# EAGLE design DS2502_Programmer_V1.0 (EAGLE 9.6.2)
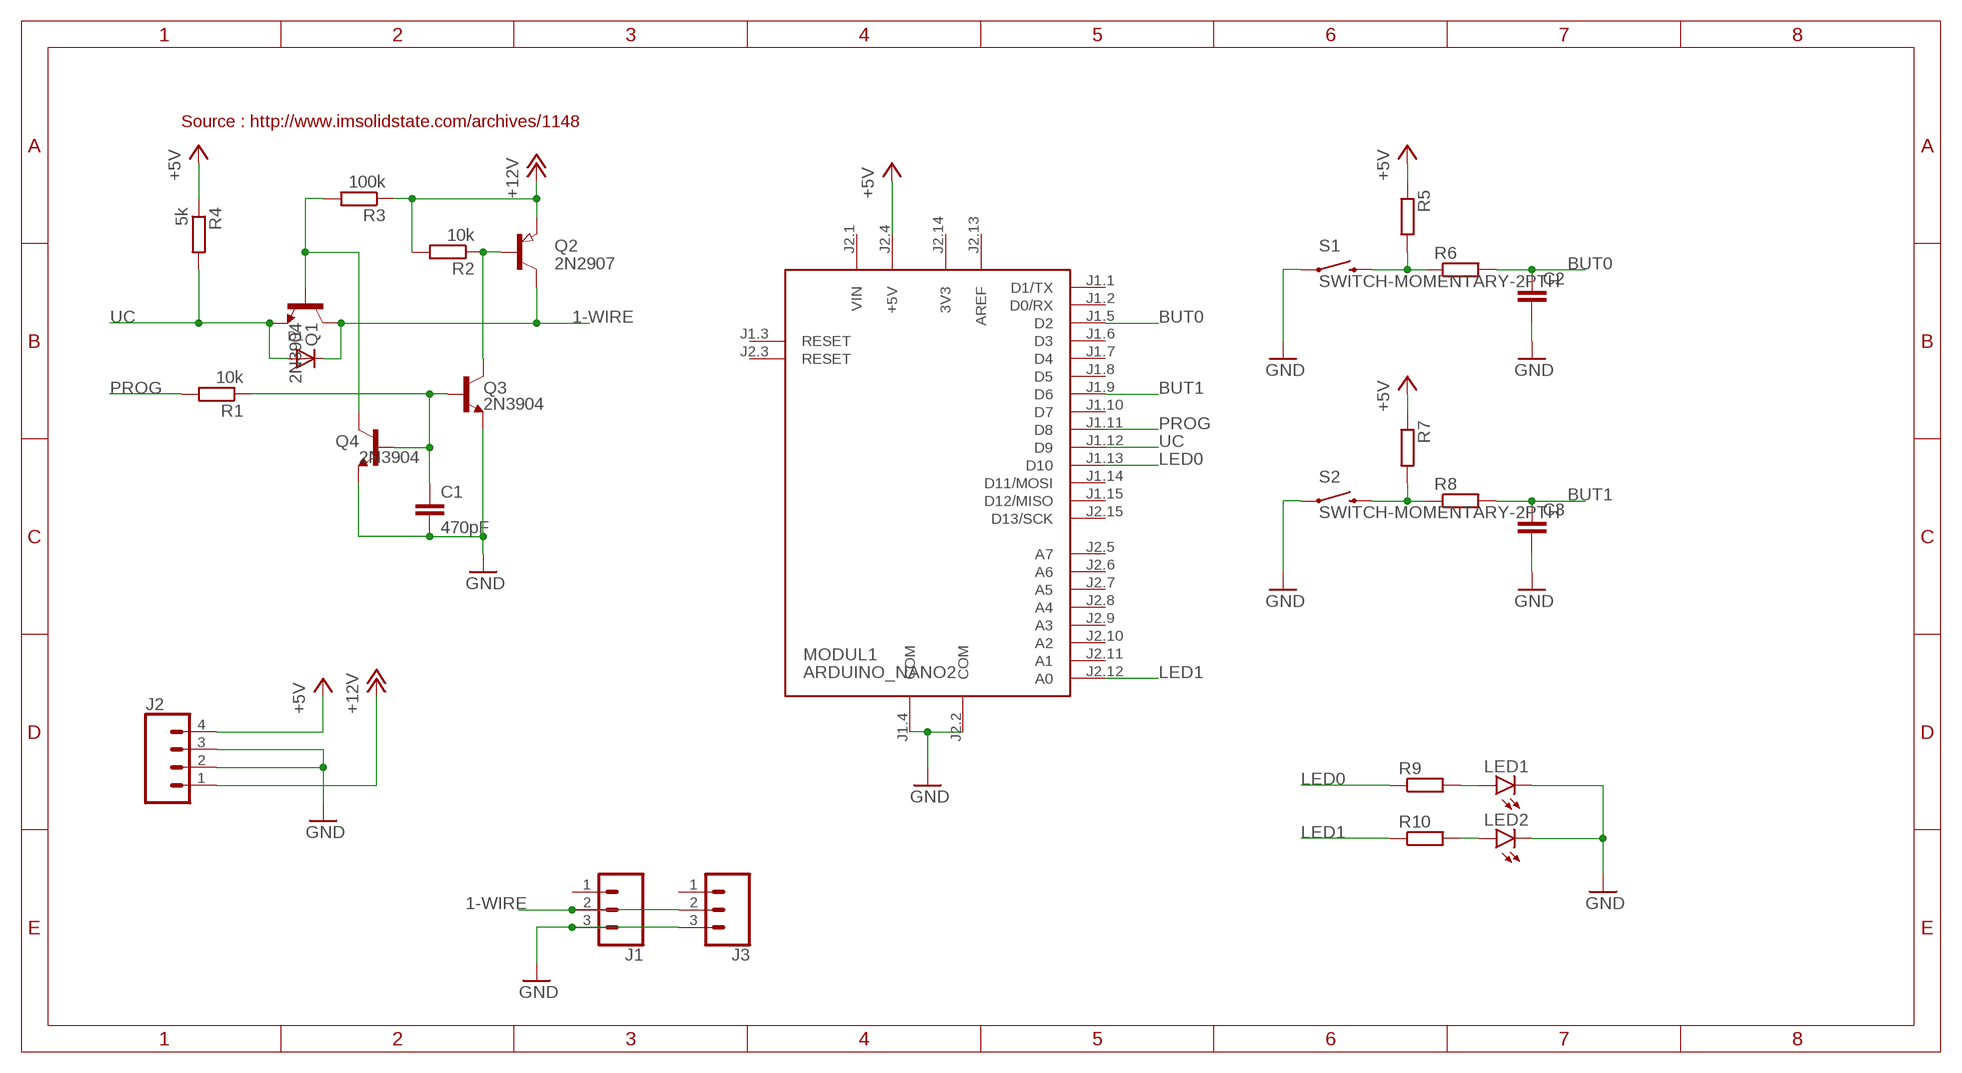
[diagram p0: schematic, sheet 1]

## Parts
C1  470pF  C-EUC0603  [C0603]
C2  C-EUC0603  [C0603]
C3  C-EUC0603  [C0603]
D1  DIODESOD-523  [SOD-523]
J1  CONN_03  [1X03]
J2  CONN_04  [1X04]
J3  CONN_03  [1X03]
LED1  LEDCHIP-LED0805  [CHIP-LED0805]
LED2  LEDCHIP-LED0805  [CHIP-LED0805]
MODUL1  ARDUINO_NANO2  [ARDUINO_NANO2]
Q1  2N3904  TRANS_NPN-MMBTA42  [SOT23-3]
Q2  2N2907  PNP-TRANSISTOR_SOT23  [SOT23]
Q3  2N3904  TRANS_NPN-MMBTA42  [SOT23-3]
Q4  2N3904  TRANS_NPN-MMBTA42  [SOT23-3]
R1  10k  R-EU_R0603  [R0603]
R2  10k  R-EU_R0603  [R0603]
R3  100k  R-EU_R0603  [R0603]
R4  5k  R-EU_R0603  [R0603]
R5  R-EU_R0603  [R0603]
R6  R-EU_R0603  [R0603]
R7  R-EU_R0603  [R0603]
R8  R-EU_R0603  [R0603]
R9  R-EU_R0603  [R0603]
R10  R-EU_R0603  [R0603]
S1  SWITCH-MOMENTARY-2PTH  [TACTILE-PTH]
S2  SWITCH-MOMENTARY-2PTH  [TACTILE-PTH]

## Nets
1-WIRE: D1.K(C) J1.2 J3.2 Q1.3(C) Q2.3(C)
+5V: J2.4 MODUL1.J2.4(+5V) R4.1 R5.1 R7.1
+12V: J2.1 Q2.2(E) R2.2 R3.1
BUT0: C2.1 MODUL1.J1.5(D2) R6.2
BUT1: C3.1 MODUL1.J1.9(D6) R8.2
GND: C1.2 C2.2 C3.2 J1.3 J2.2 J2.3 J3.3 LED1.C LED2.C MODUL1.J1.4(COM) MODUL1.J2.2(COM) Q3.2(E) Q4.2(E) S1.1 S2.1
LED0: MODUL1.J1.13(D10) R9.1
LED1: MODUL1.J2.12(A0) R10.1
N$1: Q2.1(B) Q3.3(C) R2.1
N$2: R5.2 R6.1 S1.3
N$3: R7.2 R8.1 S2.3
N$4: Q1.1(B) Q4.3(C) R3.2
N$5: LED1.A R9.2
N$6: LED2.A R10.2
N$7: C1.1 Q3.1(B) Q4.1(B) R1.1
PROG: MODUL1.J1.11(D8) R1.2
UC: D1.A MODUL1.J1.12(D9) Q1.2(E) R4.2
Unconnected: J1.1 J3.1 MODUL1.J1.1(D1/TX) MODUL1.J1.2(D0/RX) MODUL1.J1.3(RESET) MODUL1.J1.6(D3) MODUL1.J1.7(D4) MODUL1.J1.8(D5) MODUL1.J1.10(D7) MODUL1.J1.14(D11/MOSI) MODUL1.J1.15(D12/MISO) MODUL1.J2.3(RESET) MODUL1.J2.5(A7) MODUL1.J2.6(A6) MODUL1.J2.7(A5) MODUL1.J2.8(A4) MODUL1.J2.9(A3) MODUL1.J2.10(A2) MODUL1.J2.11(A1) MODUL1.J2.15(D13/SCK)

## Notes on the sheet
- Source : http://www.imsolidstate.com/archives/1148

## Power pins joined to a net without a drawn wire
3V3: MODUL1.J2.14(3V3)
AREF: MODUL1.J2.13(AREF)
VIN: MODUL1.J2.1(VIN)

## Library data of the parts
C1-C3 = rcl:C-EU: CAPACITOR, European symbol; SPICEPREFIX: C
D1 = adafruit:DIODE: Diode SMADIODE - SMA Surface Mount Package 20V 1A Schottky Diode Digikey: 641-1014-6-ND DO-1N4148 - Through Hole Small Current Diode SOD-123 20V 1 A (.5mV Vf) Schottky Diode - Digikey: MBRX120TPMSCT-ND SOD-323 10V 570mA (.38mV Vf, 3ns) Schottky Diode - Digikey: ZLLS410CT-ND SOD-523 30V 30mA Schottky Diode (RB751S-40TE61) - Digikey: RB751S-40TE61CT-ND SOT23-R/W - SOT23 Package (R = Solder Paste/Reflow Ovens, W = Hand-Soldering) BAT54Film 40V 300mA - Digikey: 497-7162-1-ND
J1 J3 = SparkFun-Connectors:CONN_03: Multi connection point. Often used as Generic Header-pin footprint for 0.1 inch spaced/style header connections On any of the 0.1 inch spaced packages, you can populate with these: Break Away Headers - Straight <https://www.sparkfun.com/products/116> (PRT-00116) Break Away Male Headers - Right Angle <https://www.sparkfun.com/products/553> (PRT-00553) Female Headers <https://www.sparkfun.com/products/115> (PRT-00115) Break Away Headers - Machine Pin <https://www.sparkfun.com/products/117> (PRT-00117) Break Away Female Headers - Swiss Machine Pin <https://www.sparkfun.com/products/743> (PRT-00743) Stackable Header - 3 Pin (Female, 0.1") <https://www.sparkfun.com/products/13875> (PRT-13875) For SCREWTERMINALS and SPRING TERMINALS visit here: Screw Terimnals on SparkFun.com <https://www.sparkfun.com/search/results?term=Screw+Terminals> (5mm/3.5mm/2.54mm spacing) This device is also useful as a general connection point to wire up your design to another part of your project. Our various solder wires solder well into these plated through hole pads. Hook-Up Wire - Assortment (Stranded, 22 AWG) <https://www.sparkfun.com/products/11375> (PRT-11375) Hook-Up Wire - Assortment (Solid Core, 22 AWG) <https://www.sparkfun.com/products/11367> (PRT-11367) View the entire wire category on our website here <https://www.sparkfun.com/categories/141> Special notes: Molex polarized connector foot print use with SKU : PRT-08232 with associated crimp pins and housings.
J2 = SparkFun-Connectors:CONN_04: Multi connection point. Often used as Generic Header-pin footprint for 0.1 inch spaced/style header connections On any of the 0.1 inch spaced packages, you can populate with these: Break Away Headers - Straight <https://www.sparkfun.com/products/116> (PRT-00116) Break Away Male Headers - Right Angle <https://www.sparkfun.com/products/553> (PRT-00553) Female Headers <https://www.sparkfun.com/products/115> (PRT-00115) Break Away Headers - Machine Pin <https://www.sparkfun.com/products/117> (PRT-00117) Break Away Female Headers - Swiss Machine Pin <https://www.sparkfun.com/products/743> (PRT-00743) For SCREWTERMINALS and SPRING TERMINALS visit here: Screw Terimnals on SparkFun.com <https://www.sparkfun.com/search/results?term=Screw+Terminals> (5mm/3.5mm/2.54mm spacing) This device is also useful as a general connection point to wire up your design to another part of your project. Our various solder wires solder well into these plated through hole pads. Hook-Up Wire - Assortment (Stranded, 22 AWG) <https://www.sparkfun.com/products/11375> (PRT-11375) Hook-Up Wire - Assortment (Solid Core, 22 AWG) <https://www.sparkfun.com/products/11367> (PRT-11367) View the entire wire category on our website here <https://www.sparkfun.com/categories/141> Special notes: Molex polarized connector foot print use with SKU : PRT-08231 with associated crimp pins and housings. 1MM SMD Version SKU: PRT-10208; PROD_ID: CONN-09696
LED1 LED2 = led:LED: LED OSRAM: - CHIPLED LG R971, LG N971, LY N971, LG Q971, LY Q971, LO R971, LY R971 LH N974, LH R974 LS Q976, LO Q976, LY Q976 LO Q996 - Hyper CHIPLED LW Q18S LB Q993, LB Q99A, LB R99A - SideLED LS A670, LO A670, LY A670, LG A670, LP A670 LB A673, LV A673, LT A673, LW A673 LH A674 LY A675 LS A676, LA A676, LO A676, LY A676, LW A676 LS A679, LY A679, LG A679 - Hyper Micro SIDELED® LS Y876, LA Y876, LO Y876, LY Y876 LT Y87S - SmartLED LW L88C, LW L88S LB L89C, LB L89S, LG L890 LS L89K, LO L89K, LY L89K LS L896, LA L896, LO L896, LY L896 - TOPLED LS T670, LO T670, LY T670, LG T670, LP T670 LSG T670, LSP T670, LSY T670, LOP T670, LYG T670 LG T671, LOG T671, LSG T671 LB T673, LV T673, LT T673, LW T673 LH T674 LS T676, LA T676, LO T676, LY T676, LB T676, LH T676, LSB T676, LW T676 LB T67C, LV T67C, LT T67C, LS T67K, LO T67K, LY T67K, LW E67C LS E67B, LA E67B, LO E67B, LY E67B, LB E67C, LV E67C, LT E67C LW T67C LS T679, LY T679, LG T679 LS T770, LO T770, LY T770, LG T770, LP T770 LB T773, LV T773, LT T773, LW T773 LH T774 LS E675, LA E675, LY E675, LS T675 LS T776, LA T776, LO T776, LY T776, LB T776 LHGB T686 LT T68C, LB T68C - Hyper Mini TOPLED® LB M676 - Mini TOPLED Santana® LG M470 LS M47K, LO M47K, LY M47K Source: http://www.osram.convergy.de LUXEON: - LUMILED® LXK2-PW12-R00, LXK2-PW12-S00, LXK2-PW14-U00, LXK2-PW14-V00 LXK2-PM12-R00, LXK2-PM12-S00, LXK2-PM14-U00 LXK2-PE12-Q00, LXK2-PE12-R00, LXK2-PE12-S00, LXK2-PE14-T00, LXK2-PE14-U00 LXK2-PB12-K00, LXK2-PB12-L00, LXK2-PB12-M00, LXK2-PB14-N00, LXK2-PB14-P00, LXK2-PB14-Q00 LXK2-PR12-L00, LXK2-PR12-M00, LXK2-PR14-Q00, LXK2-PR14-R00 LXK2-PD12-Q00, LXK2-PD12-R00, LXK2-PD12-S00 LXK2-PH12-R00, LXK2-PH12-S00 LXK2-PL12-P00, LXK2-PL12-Q00, LXK2-PL12-R00 Source: www.luxeon.com KINGBRIGHT: KA-3528ASYC Source: www.kingbright.com
MODUL1 = arduino:ARDUINO_NANO2: Arduino Nano2 Auto generated by modulcreator.ulp \;; ANZAHL: 2; MODUL: TRUE; STECKX0: -76200; STECKX1: 76200; STECKY0: 177800; STECKY1: 177800
Q1 Q3 Q4 = SparkFun-DiscreteSemi:TRANS_NPN: NPN transistor Current controlled devices typically used to amplify current or used as a switch. BC547 - COM-08928 <http://www.sparkfun.com/products/8928> (TO-92 45V 100mA) (1.Collector 2.Base 3.Emitter) 2N3904 - COM-00521 <http://www.sparkfun.com/products/521> (TO-92 40V 200mA) (1.Emitter 2.Base 3.Collector) P2N2222A - COM-12852 <http://www.sparkfun.com/products/12852> (TO-92 40V 600mA) (1.Collector 2.Base 3.Emitter); PROD_ID: TRANS-09116; VALUE: 500mA/300V
Q2 = semicon-smd-ipc:PNP-TRANSISTOR_: PNP TRANSISTOR
R1-R10 = rcl:R-EU_: RESISTOR, European symbol; SPICEPREFIX: R
S1 S2 = SparkFun:SWITCH-MOMENTARY-2

## Board
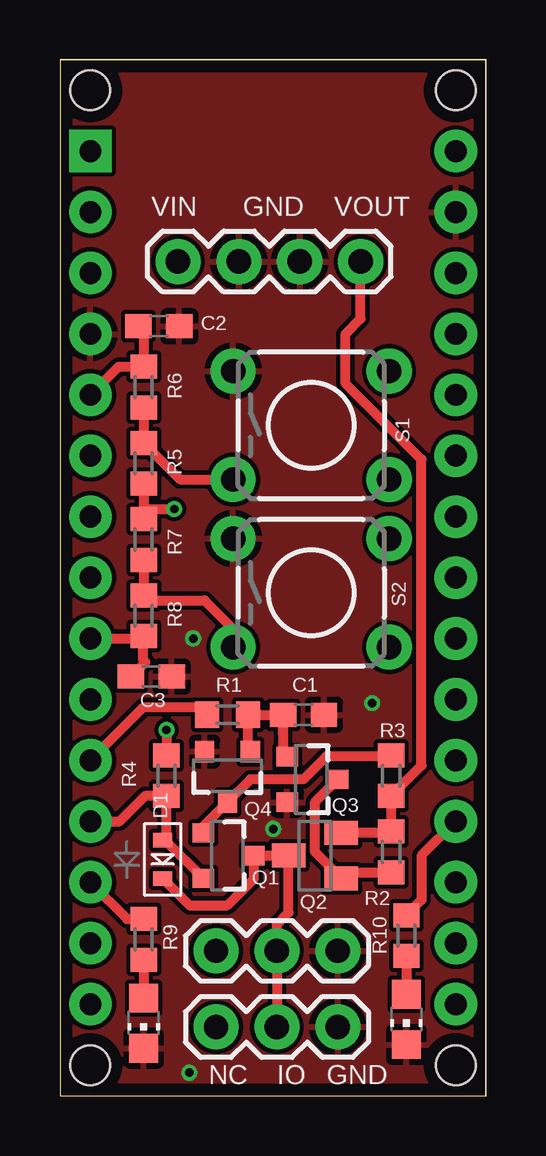
[diagram p1: board, top side]
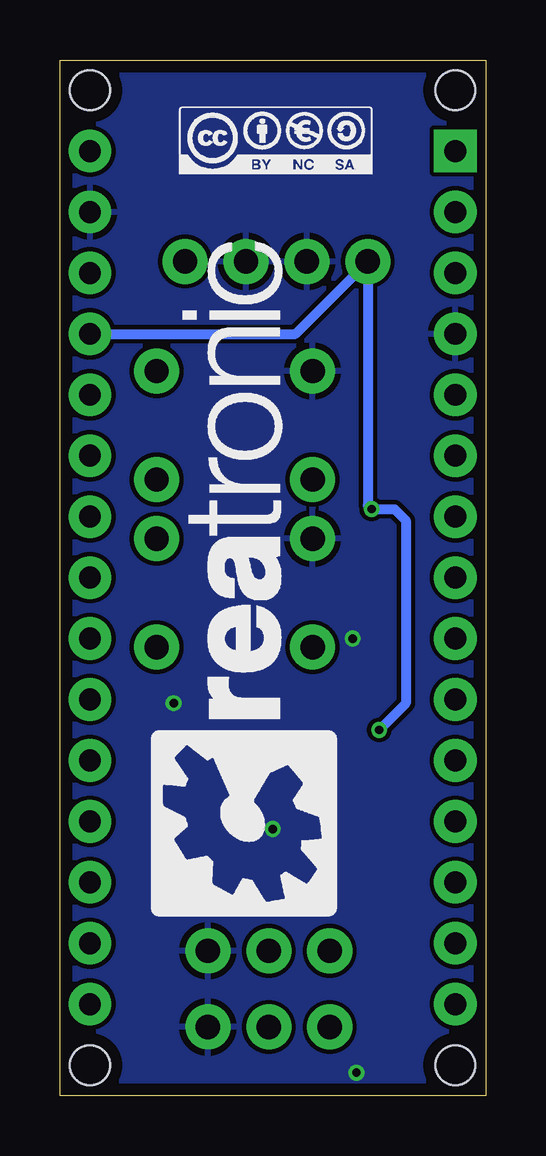
[diagram p2: board, bottom side, seen from below]

Size 17.76 x 43.17 mm. Coordinates in mm from the lower left corner, seen from the top.
Outline: 0,0 17.76,0 17.76,43.17 0,43.17 0,0
Copper layers (1*16): Top 0.035mm / dielectric 1.5mm / Bottom 0.035mm
Design rules "BATDRU": minimum track width 7mil, minimum drill 12mil, track to track 7mil, track to pad 7mil, pad to pad 7mil, via to via 7mil, smd to smd 0mil, copper to edge 20mil, drill to drill 10mil, minimum pad ring 10mil, minimum via ring 6mil, stop-mask expansion 2mil, vias tented up to drill 25mil, thermal gap 10mil

### Footprints (pad centres in the part's own frame; a part is rotated, then mirrored left to right if it is on the bottom)
C0603 = smd 1.1 x 1: 1 -0.85,0; 2 0.85,0
SOD-523 = smd 0.8 x 0.6: A 0,-0.8; K 0,0.8
1X03 = drill 1.016 pad 1.88: 1 0,0; 2 2.54,0; 3 5.08,0
1X04 = drill 1.016 pad 1.88: 1 0,0; 2 2.54,0; 3 5.08,0; 4 7.62,0
CHIP-LED0805 = smd 1.2 x 1.2: A 0,-1.05; C 0,1.05
ARDUINO_NANO2 = drill 0.914 pad 1.778 square: J1.1 -7.62,17.78 | drill 0.914 pad 1.778: J1.2 -7.62,15.24; J1.3 -7.62,12.7; J1.4 -7.62,10.16; J1.5 -7.62,7.62; J1.6 -7.62,5.08; J1.7 -7.62,2.54; J1.8 -7.62,0; J1.9 -7.62,-2.54; J1.10 -7.62,-5.08; J1.11 -7.62,-7.62; J1.12 -7.62,-10.16; J1.13 -7.62,-12.7; J1.14 -7.62,-15.24; J1.15 -7.62,-17.78; J2.1 7.62,17.78; J2.2 7.62,15.24; J2.3 7.62,12.7; J2.4 7.62,10.16; J2.5 7.62,7.62; J2.6 7.62,5.08; J2.7 7.62,2.54; J2.8 7.62,0; J2.9 7.62,-2.54; J2.10 7.62,-5.08; J2.11 7.62,-7.62; J2.12 7.62,-10.16; J2.13 7.62,-12.7; J2.14 7.62,-15.24; J2.15 7.62,-17.78 | hole 1.651: -7.62,-20.32; 7.62,-20.32; 7.62,20.32; -7.62,20.32
SOT23-3 = smd 0.8 x 0.9: 1 -0.95,-1; 2 0.95,-1; 3 0,1.1
SOT23 = smd 1 x 1.4: 1 -0.95,-1.1; 2 0.95,-1.1; 3 0,1.1
R0603 = smd 1 x 1.1: 1 -0.85,0; 2 0.85,0
TACTILE-PTH = drill 1.016 pad 1.88: 1 -3.251,2.261; 2 3.251,2.261; 3 -3.251,-2.261; 4 3.251,-2.261

### Placement (x,y rotation side)
C1  10.16,15.88 0 top
C2  4.13,32.07 0 top
C3  3.81,17.46 0 top
D1  4.29,9.84 180 top
J1  6.51,6.03 0 top
J2  12.54,34.77 180 top
J3  6.51,2.86 0 top
LED1  3.49,3.02 180 top
LED2  14.45,3.17 180 top
MODUL1  8.89,21.59 0 top
Q1  6.99,10 270 top
Q2  10.64,10 90 top
Q3  10.48,13.18 270 top
Q4  6.99,13.34 180 top
R1  6.99,15.88 180 top
R2  13.81,10.16 90 top
R3  13.81,13.34 90 top
R4  4.45,13.34 270 top
R5  3.49,26.35 90 top
R6  3.49,29.53 90 top
R7  3.49,23.18 270 top
R8  3.49,20 270 top
R9  3.49,6.51 270 top
R10  14.45,6.67 270 top
S1  10.48,27.94 0 top
S2  10.48,20.95 0 top
U$1  [CC_BY_NC_SA_1]  11.91,39.53 0 top
U$3  [CREATRONIC_4]  10.16,10.95 270 top

### Tracks (layer width: path | path; a pad name or v marks a point on that pad's centre or on a via)
1-WIRE
  Top 0.406: D1.K 5.4,7.94 6.99,7.94 8.09,9.04 Q1.3 Q2.3 9.54,7.63 9.05,7.14 J1.2 J3.2
+5V  (via drill 0.35)
  Top 0.406: v4.45,15.24 R4.1 | R5.1 3.49,24.45 | 3.49,24.45 R7.1 | 3.49,24.45 v4.76,24.45
  Bottom 0.406: v4.45,15.24 3.33,16.35 3.33,23.97 3.81,24.45 v4.76,24.45 4.92,24.61 J2.4 7.94,31.75 MODUL1.J2.4
+12V
  Top 0.406: Q2.2 13.81,10.95 R2.2 | 13.71,11.11 R2.2 | R2.2 R3.1 15.08,13.76 15.08,26.51 11.91,29.69 11.91,31.75 12.54,32.38 J2.1
BUT0
  Top 0.406: C2.1 3.49,31.85 R6.2 2.44,30.38 MODUL1.J1.5
BUT1
  Top 0.406: C3.1 3.56,18.07 3.45,18.2 3.45,19.11 R8.2 3.39,19.05 MODUL1.J1.9
GND  (via drill 0.35)
  other vias: 13.02,16.35 5.4,0.95 5.56,19.05 8.89,11.11
  pour Top: -0.79,43.97 -0.79,-0.79 19.21,-0.79 19.21,43.97
  pour Bottom: -1.43,44.13 -1.43,-1.11 18.89,-1.11 18.89,44.13
LED0
  Top 0.406: MODUL1.J1.13 2.8,7.36 R9.1
LED1
  Top 0.406: MODUL1.J2.12 15.08,10 15.08,8.15 R10.1
N$1
  Top 0.406: R2.1 11.99,9.31 Q2.1 10.64,10.15 10.64,12.23 Q3.3
N$2
  Top 0.406: R6.1 R5.2 5.02,25.68 S1.3
N$3
  Top 0.406: R7.2 R8.1 3.71,20.64 6.03,20.64 7.23,19.44 S2.3
N$4
  Top 0.406: Q1.1 5.99,11.23 Q4.3 7.94,13.19 10.16,13.19 11.11,14.14 13.77,14.14 R3.2
N$5
  Top 0.406: R9.2 LED1.A
N$6
  Top 0.406: R10.2 LED2.A
N$7
  Top 0.406: Q4.1 7.83,14.44 R1.1 C1.1 | 9.31,15.03 C1.1 | C1.1 9.31,14.29 Q3.1
PROG
  Top 0.406: R1.2 5.82,16.19 3.49,16.19 MODUL1.J1.11
UC
  Top 0.406: MODUL1.J1.12 2.5,11.43 3.55,12.48 R4.2 4.45,10.8 D1.A 4.39,10.64 Q1.2

### Text on the board
tPlace: VIN | GND | VOUT | NC | IO | GND